# Altium schematic sheet audio.SchDoc
size A3
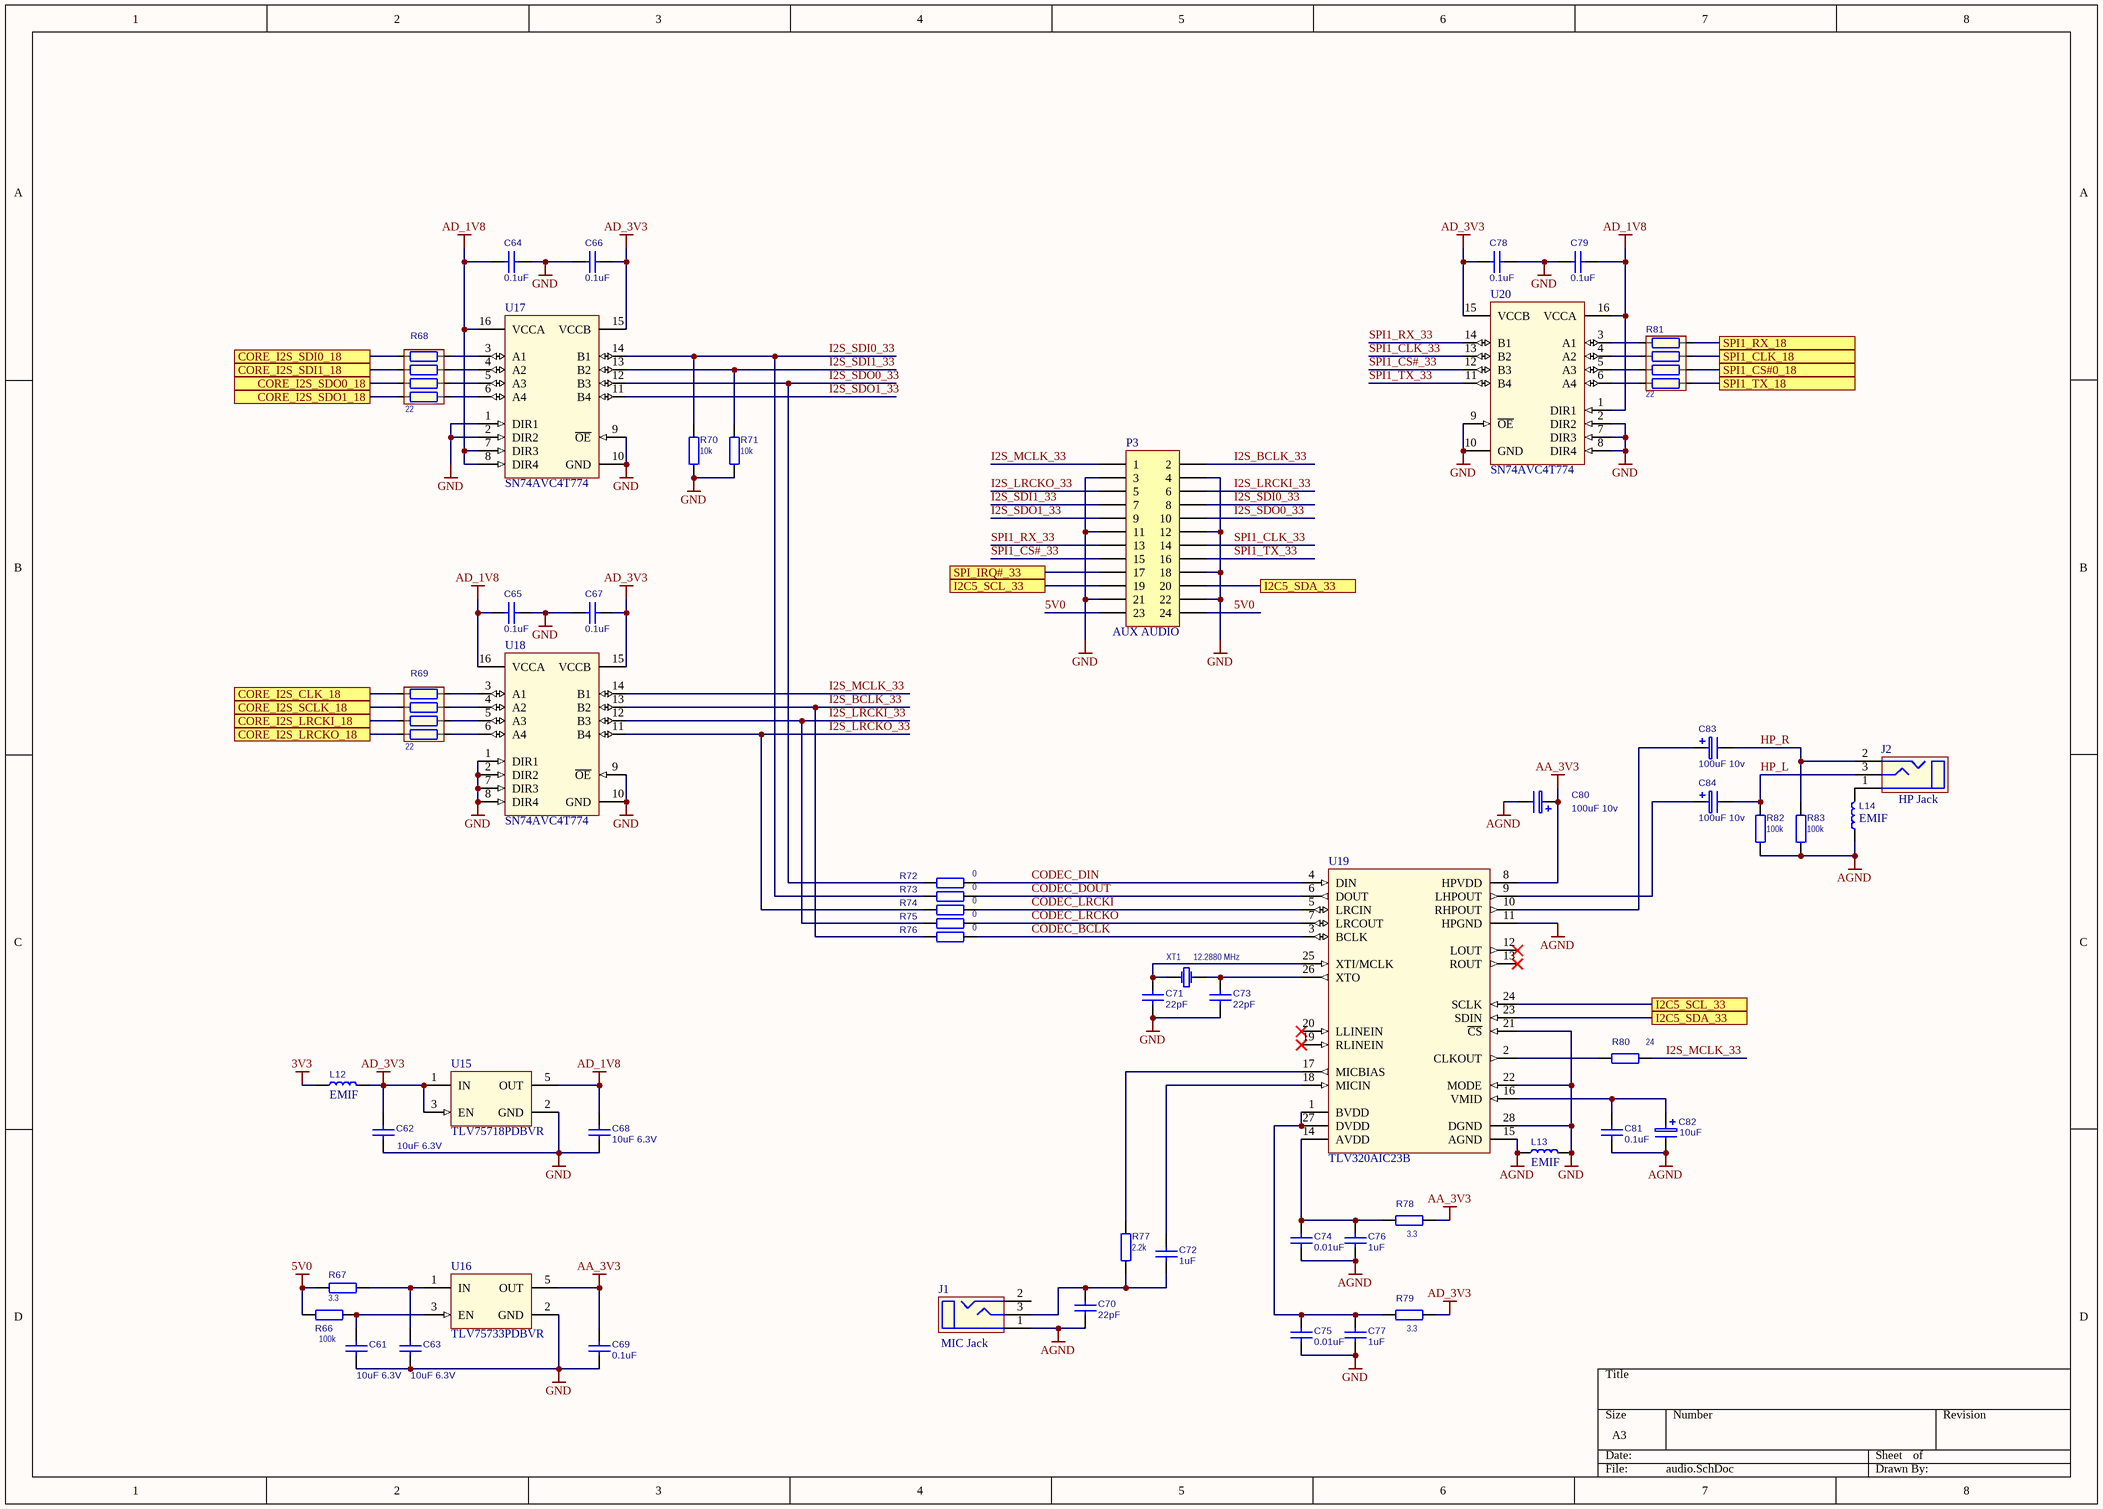
[diagram p0: audio.SchDoc]

## Parts
C61  value 10uF 6.3V  [C0603]  (hidden comment: CC0603MRX5R5BB106)
C62  value 10uF 6.3V  [C0603]  (hidden comment: CC0603MRX5R5BB106)
C63  value 10uF 6.3V  [C0603]  (hidden comment: CC0603MRX5R5BB106)
C64  value 0.1uF  [C0603]  (hidden comment: C1608X7R1H104K080AA)
C65  value 0.1uF  [C0603]  (hidden comment: C1608X7R1H104K080AA)
C66  value 0.1uF  [C0603]  (hidden comment: C1608X7R1H104K080AA)
C67  value 0.1uF  [C0603]  (hidden comment: C1608X7R1H104K080AA)
C68  value 10uF 6.3V  [C0603]  (hidden comment: CC0603MRX5R5BB106)
C69  value 0.1uF  [C0603]  (hidden comment: C1608X7R1H104K080AA)
C70  22pF  [C0603]
C71  22pF  [C0603]
C72  value 1uF  [C0603]  (hidden comment: GRM188R61H105KAALD)
C73  22pF  [C0603]
C74  value 0.01uF  [C0603]  (hidden comment: C1608X7R1H104K080AA)
C75  value 0.01uF  [C0603]  (hidden comment: C1608X7R1H104K080AA)
C76  value 1uF  [C0603]  (hidden comment: GRM188R61H105KAALD)
C77  value 1uF  [C0603]  (hidden comment: GRM188R61H105KAALD)
C78  value 0.1uF  [C0603]  (hidden comment: C1608X7R1H104K080AA)
C79  value 0.1uF  [C0603]  (hidden comment: C1608X7R1H104K080AA)
C80  value 100uF 10v  [R06H11]  (hidden comment: SH010M0100B2F-0511)
C81  value 0.1uF  [C0603]  (hidden comment: C1608X7R1H104K080AA)
C82  value 10uF  [TANTAL-A-1206]  (hidden comment: CAP_POL)
C83  value 100uF 10v  [R06H11]  (hidden comment: SH010M0100B2F-0511)
C84  value 100uF 10v  [R06H11]  (hidden comment: SH010M0100B2F-0511)
J1  value MIC Jack  [AUB-13]  (hidden comment: AUB-13)
J2  value HP Jack  [AUB-13]  (hidden comment: AUB-13)
L12  value EMIF  [IND0805]  (hidden comment: BLM21PG221SN1D)
L13  value EMIF  [IND0805]  (hidden comment: BLM21PG221SN1D)
L14  value EMIF  [IND0805]  (hidden comment: BLM21PG221SN1D)
P3  AUX AUDIO  [PLD-12]
R66  100k  [R0603]
R67  3.3  [R1206]
R68  value 22  [R0804X4]  (hidden comment: TC124-JR-0722RL)
R69  value 22  [R0804X4]  (hidden comment: TC124-JR-0722RL)
R70  10k  [R0603]
R71  10k  [R0603]
R72  0  [R0603]
R73  0  [R0603]
R74  0  [R0603]
R75  0  [R0603]
R76  0  [R0603]
R77  2.2k  [R0603]
R78  3.3  [R1206]
R79  3.3  [R1206]
R80  value 24  [R0603]  (hidden comment: 22)
R81  value 22  [R0804X4]  (hidden comment: TC124-JR-0722RL)
R82  100k  [R0603]
R83  100k  [R0603]
U15  TLV75718PDBVR  [SOT-23-5]
U16  TLV75733PDBVR  [SOT-23-5]
U17  SN74AVC4T774  [TSSOP-16]
U18  SN74AVC4T774  [TSSOP-16]
U19  TLV320AIC23B  [TSSOP-28]
U20  SN74AVC4T774  [TSSOP-16]
XT1  value 12.2880 MHz  [HC-49/S]  (hidden comment: KX-3H 12.2880 MHz)

## Ports
CORE_I2S_CLK_18, CORE_I2S_LRCKI_18, CORE_I2S_LRCKO_18, CORE_I2S_SCLK_18, CORE_I2S_SDI0_18, CORE_I2S_SDI1_18, CORE_I2S_SDO0_18, CORE_I2S_SDO1_18, I2C5_SCL_33, I2C5_SDA_33, SPI1_CLK_18, SPI1_CS#0_18, SPI1_RX_18, SPI1_TX_18, SPI_IRQ#_33

## Nets
3V3: L12.2
5V0: P3.23 P3.24 R66.1 R67.2
AA_3V3: C69.1 C80.1(+) R78.1 U16.5(OUT) U19.8(HPVDD)
AD_1V8: C64.2 C65.2 C68.1 C79.2 U15.5(OUT) U17.7(DIR3) U17.8(DIR4) U17.16(VCCA) U18.16(VCCA) U20.1(DIR1) U20.16(VCCA)
AD_3V3: C62.1 C66.1 C67.1 C78.1 L12.1 R79.1 U15.1(IN) U15.3(EN) U17.15(VCCB) U18.15(VCCB) U20.15(VCCB)
AGND: C70.2 C74.2 C76.1 C80.2(-) C81.2 C82.2(-) J1.1(C) L13.2 L14.2 R82.2 R83.2 U19.11(HPGND) U19.15(AGND)
GND: C61.2 C62.2 C63.2 C64.1 C65.1 C66.2 C67.2 C68.2 C69.2 C71.1 C73.1 C75.2 C77.1 C78.2 C79.1 L13.1 P3.3 P3.4 P3.11 P3.12 P3.18 P3.21 P3.22 R70.2 R71.2 U15.2(GND) U16.2(GND) U17.1(DIR1) U17.2(DIR2) U17.9(~{OE}) U17.10(GND) U18.1(DIR1) U18.2(DIR2) U18.7(DIR3) U18.8(DIR4) U18.9(~{OE}) U18.10(GND) U19.21(~{CS}) U19.22(MODE) U19.28(DGND) U20.2(DIR2) U20.7(DIR3) U20.8(DIR4) U20.9(~{OE}) U20.10(GND)
CODEC_BCLK: R76.2 U19.3(BCLK)
CODEC_DIN: R72.2 U19.4(DIN)
CODEC_DOUT: R73.2 U19.6(DOUT)
CODEC_LRCKI: R74.2 U19.5(LRCIN)
CODEC_LRCKO: R75.2 U19.7(LRCOUT)
CORE_I2S_CLK_18: R69.1 ; port CORE_I2S_CLK_18
CORE_I2S_LRCKI_18: R69.5 ; port CORE_I2S_LRCKI_18
CORE_I2S_LRCKO_18: R69.7 ; port CORE_I2S_LRCKO_18
CORE_I2S_SCLK_18: R69.3 ; port CORE_I2S_SCLK_18
CORE_I2S_SDI0_18: R68.1 ; port CORE_I2S_SDI0_18
CORE_I2S_SDI1_18: R68.3 ; port CORE_I2S_SDI1_18
CORE_I2S_SDO0_18: R68.5 ; port CORE_I2S_SDO0_18
CORE_I2S_SDO1_18: R68.7 ; port CORE_I2S_SDO1_18
HP_L: C84.2(-) J2.3(L) R82.1
HP_R: C83.2(-) J2.2(R) R83.1
I2C5_SCL_33: P3.19 U19.24(SCLK) ; port I2C5_SCL_33
I2C5_SDA_33: P3.20 U19.23(SDIN) ; port I2C5_SDA_33
I2S_BCLK_33: P3.2 R76.1 U18.13(B2)
I2S_LRCKI_33: P3.6 R75.1 U18.12(B3)
I2S_LRCKO_33: P3.5 R74.1 U18.11(B4)
I2S_MCLK_33: P3.1 R80.1 U18.14(B1)
I2S_SDI0_33: P3.8 R70.1 R73.1 U17.14(B1)
I2S_SDI1_33: P3.7 R71.1 U17.13(B2)
I2S_SDO0_33: P3.10 R72.1 U17.12(B3)
I2S_SDO1_33: P3.9 U17.11(B4)
SPI1_CLK_18: R81.3 ; port SPI1_CLK_18
SPI1_CLK_33: P3.14 U20.13(B2)
SPI1_CS#0_18: R81.5 ; port SPI1_CS#0_18
SPI1_CS#_33: P3.15 U20.12(B3)
SPI1_RX_18: R81.1 ; port SPI1_RX_18
SPI1_RX_33: P3.13 U20.14(B1)
SPI1_TX_18: R81.7 ; port SPI1_TX_18
SPI1_TX_33: P3.16 U20.11(B4)
SPI_IRQ#_33: P3.17 ; port SPI_IRQ#_33
NetC61_1: C61.1 R66.2 U16.3(EN)
NetC63_1: C63.1 R67.1 U16.1(IN)
NetC70_1: C70.1 C72.2 J1.3(L) R77.2
NetC71_2: C71.2 U19.25(XTI/MCLK) XT1.1
NetC72_1: C72.1 U19.18(MICIN)
NetC73_2: C73.2 U19.26(XTO) XT1.2
NetC74_1: C74.1 C76.2 R78.2 U19.14(AVDD)
NetC75_1: C75.1 C77.2 R79.2 U19.1(BVDD) U19.27(DVDD)
NetC81_1: C81.1 C82.1(+) U19.16(VMID)
NetC83_1: C83.1(+) U19.10(RHPOUT)
NetC84_1: C84.1(+) U19.9(LHPOUT)
NetJ2_1: J2.1(C) L14.1
NetR68_2: R68.2 U17.3(A1)
NetR68_4: R68.4 U17.4(A2)
NetR68_6: R68.6 U17.5(A3)
NetR68_8: R68.8 U17.6(A4)
NetR69_2: R69.2 U18.3(A1)
NetR69_4: R69.4 U18.4(A2)
NetR69_6: R69.6 U18.5(A3)
NetR69_8: R69.8 U18.6(A4)
NetR77_1: R77.1 U19.17(MICBIAS)
NetR80_2: R80.2 U19.2(CLKOUT)
NetR81_2: R81.2 U20.3(A1)
NetR81_4: R81.4 U20.4(A2)
NetR81_6: R81.6 U20.5(A3)
NetR81_8: R81.8 U20.6(A4)

Not connected (* = marked no-connect by the designer): J1 2(R); U19 12(LOUT)* 13(ROUT)* 19(RLINEIN)* 20(LLINEIN)*

## Library data of the parts
C61-C79 C81 = CAP_NPOL
  C70 C71 C73: Value: 22pF
C80 C83 C84 = CAP_POL
J1 J2 = PhoneJackStereo: Phonejack Stereo
L12-L14 = IND_WO_IRON
P3 = HDR 12X2: Header, 12-Pin, Dual row; LatestRevisionDate: 17-Jul-2002; LatestRevisionNote: Re-released for DXP Platform.; Publisher: Altium Limited
R66 R67 R70-R80 R82 R83 = RESISTOR: RES
  R66 R82 R83: Value: 100k
  R67 R78 R79: Value: 3.3
  R70 R71: Value: 10k
  R72-R76: Value: 0
  R77: Value: 2.2k
R68 R69 R81 = ARRAY
U15 U16 = TLV733P: Capacitor-Free, 300-mA, Low-Dropout Regulator with Foldback Current Limit for Portable Devices; value: TLV733P
U17 U18 U20 = SN74AVC4T774: 4-Bit Dual-Supply Bus Transceiver With Configurable Voltage-Level Shifting and 3-State Outputs; value: SN74AVC4T774
U19 = TLV320AIC23: Stereo Audio CODEC
XT1 = XTAL